# Altium project Flight Controller.PrjPcb
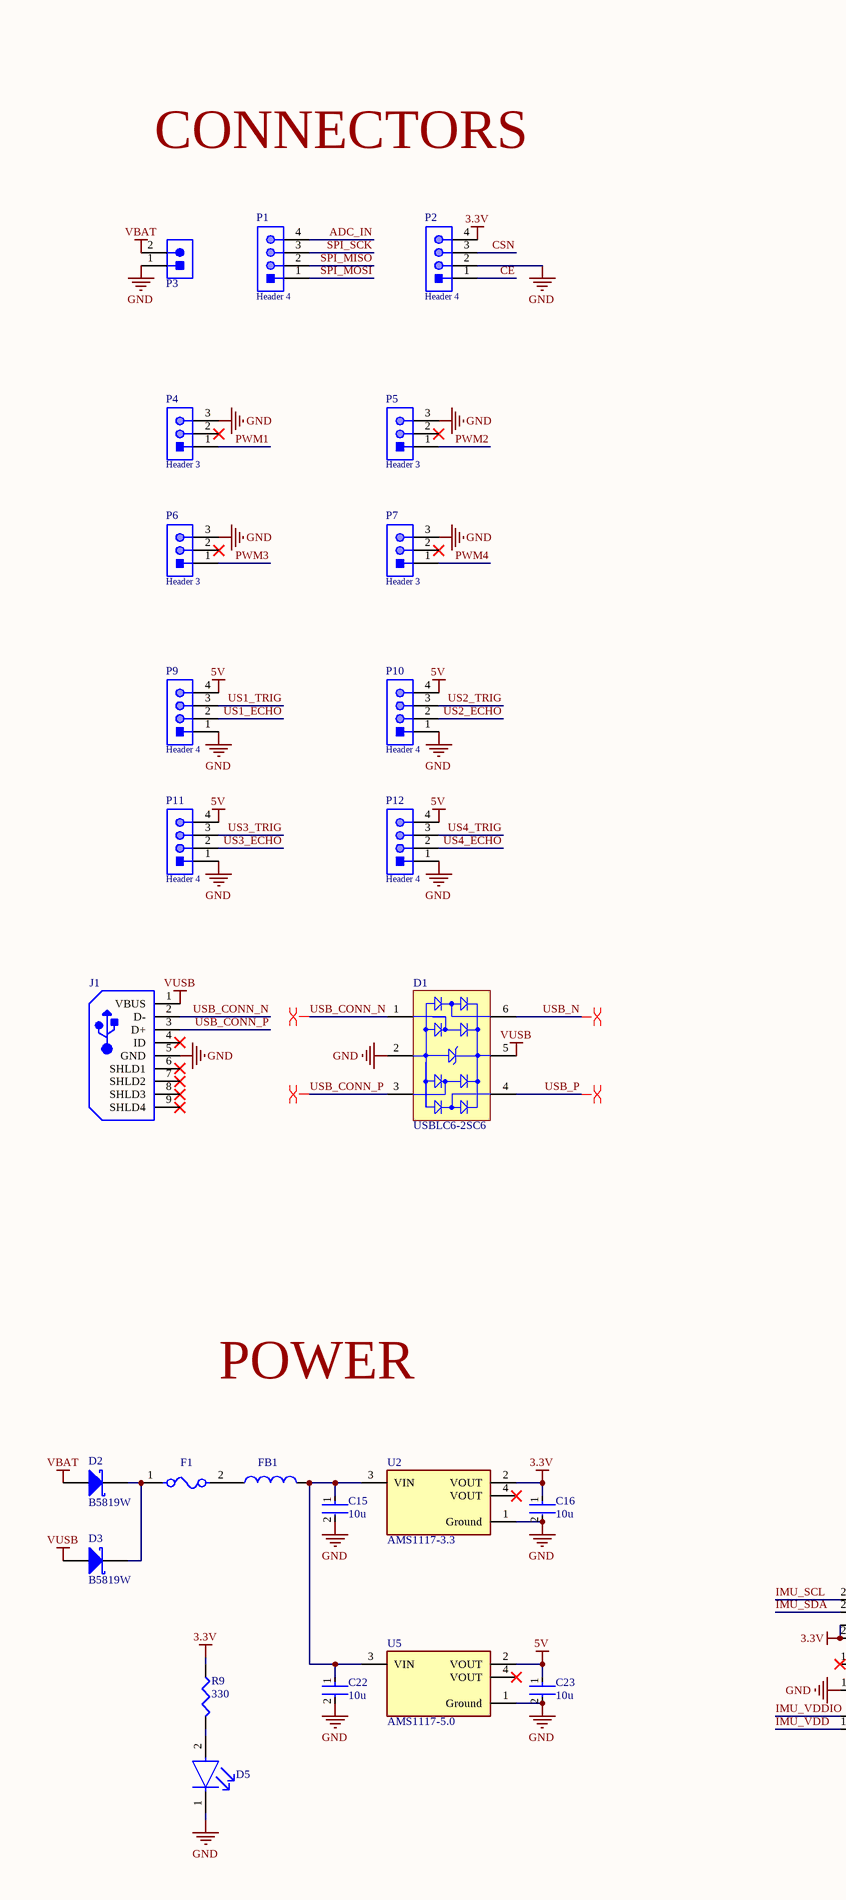
[diagram p0: Flight Controller.SchDoc, left]
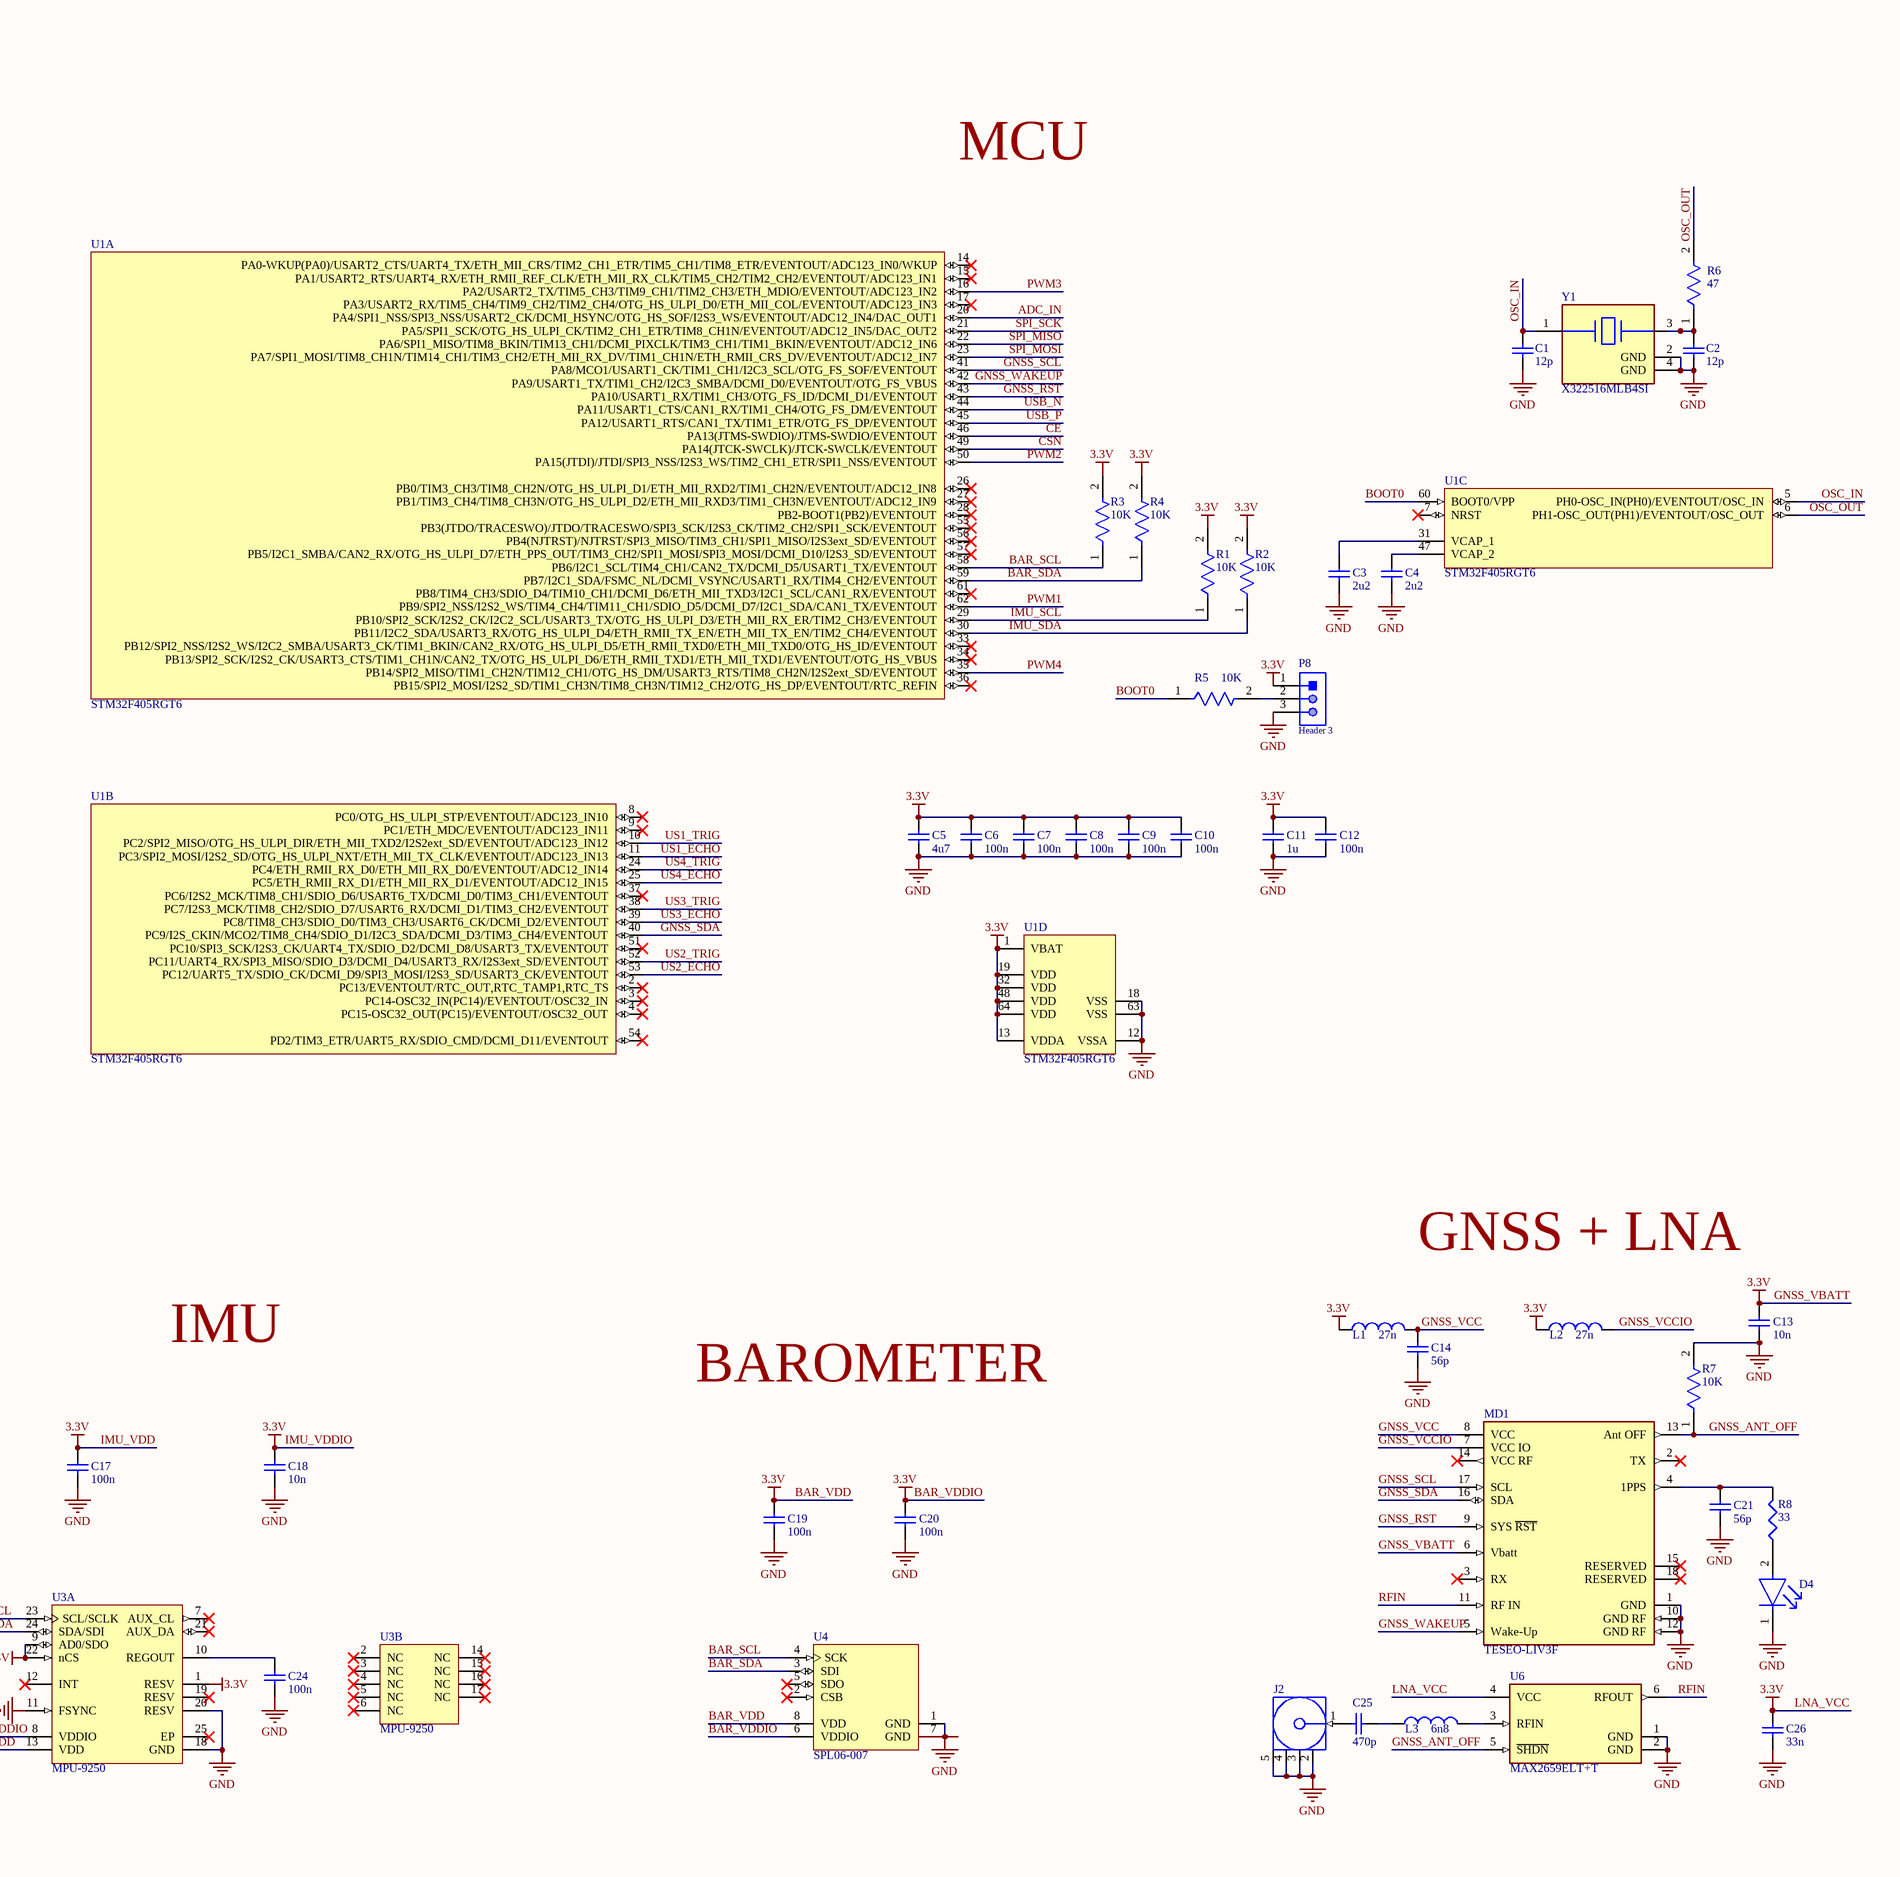
[diagram p1: Flight Controller.SchDoc, right]
1 sheet, 67 parts. Net scope: global (net labels, ports and power ports of the same name join across sheets).
Board file: Flight Controller.PcbDoc

## Sheet Flight Controller.SchDoc
size A2

### Parts
C1  value 12p  [0402]  (hidden comment: Cap Semi)
C2  value 12p  [0402]  (hidden comment: Cap Semi)
C3  value 2u2  [1608[0603]]  (hidden comment: Cap Semi)
C4  value 2u2  [1608[0603]]  (hidden comment: Cap Semi)
C5  value 4u7  [1608[0603]]  (hidden comment: Cap Semi)
C6  value 100n  [0402]  (hidden comment: Cap Semi)
C7  value 100n  [0402]  (hidden comment: Cap Semi)
C8  value 100n  [0402]  (hidden comment: Cap Semi)
C9  value 100n  [0402]  (hidden comment: Cap Semi)
C10  value 100n  [0402]  (hidden comment: Cap Semi)
C11  value 1u  [1608[0603]]  (hidden comment: Cap Semi)
C12  value 100n  [0402]  (hidden comment: Cap Semi)
C13  value 10n  [0402]  (hidden comment: Cap Semi)
C14  value 56p  [0402]  (hidden comment: Cap Semi)
C15  10u  [FP-CL21-IPC_B]
C16  10u  [FP-CL21-IPC_B]
C17  value 100n  [0402]  (hidden comment: Cap Semi)
C18  value 10n  [0402]  (hidden comment: Cap Semi)
C19  value 100n  [0402]  (hidden comment: Cap Semi)
C20  value 100n  [0402]  (hidden comment: Cap Semi)
C21  value 56p  [0402]  (hidden comment: Cap Semi)
C22  10u  [FP-CL21-IPC_B]
C23  10u  [FP-CL21-IPC_B]
C24  value 100n  [0402]  (hidden comment: Cap Semi)
C25  value 470p  [0402]  (hidden comment: Cap Semi)
C26  value 33n  [0402]  (hidden comment: Cap Semi)
D1  USBLC6-2SC6  [STM-SOT23-6L_V]
D2  B5819W  [MCC-SOD123_V]
D3  B5819W  [MCC-SOD123_V]
D4  597-3901-831F  [FP-597-MFG]  (value not drawn)
D5  597-3901-831F  [FP-597-MFG]  (value not drawn)
F1  nSMD050-24V  [FP-0466-MFG]  (value not drawn)
FB1  GZ2012D601TF  [SNLD-CHIP2-2012X105_V]  (value not drawn)
J1  65100516121  [WE-65100516121_V]  (value not drawn)
J2  CONSMA001  [CON-SMA]  (value not drawn)
L1  value 27n  [0402-A]  (hidden comment: Inductor)
L2  value 27n  [0402-A]  (hidden comment: Inductor)
L3  value 6n8  [0402-A]  (hidden comment: Inductor)
MD1  TESEO-LIV3F  [FP-LCC-18-MFG]
P1  Header 4  [61300411121]
P2  Header 4  [61300411121]
P3  SCREW-5.0/5.08 2WAYS  [SCREW-5.0-2WAYS_V]  (value not drawn)
P4  Header 3  [61300311121]
P5  Header 3  [61300311121]
P6  Header 3  [61300311121]
P7  Header 3  [61300311121]
P8  Header 3  [61300311121]
P9  Header 4  [61300411121]
P10  Header 4  [61300411121]
P11  Header 4  [61300411121]
P12  Header 4  [61300411121]
R1  10K  [FP-CRCW0402-e3-MFG]
R2  10K  [FP-CRCW0402-e3-MFG]
R3  10K  [FP-CRCW0402-e3-MFG]
R4  10K  [FP-CRCW0402-e3-MFG]
R5  10K  [FP-CRCW0402-e3-MFG]
R6  47  [FP-CRCW0402-e3-MFG]
R7  10K  [FP-CRCW0402-e3-MFG]
R8  value 33  [J1-0603]  (hidden comment: Res3)
R9  value 330  [J1-0603]  (hidden comment: Res3)
U1  STM32F405RGT6  [STM-LQFP64_N]  (parts A,B,C,D of 4)
U2  AMS1117-3.3  [FP-AMS1117-IPC_C]
U3  MPU-9250  [INSE-QFN-24-1700X1540TP_M]  (parts A,B of 2)
U4  SPL06-007  [BOSC-LGA-8_V]
U5  AMS1117-5.0  [FP-AMS1117-IPC_C]
U6  MAX2659ELT+T  [FP-L611-2-MFG]
Y1  X322516MLB4SI  [FP-XRCJK-MFG]

### Nets
5V: C23.1 P9.4 P10.4 P11.4 P12.4 U5.2(VOUT)
BAR_VDD: C5.2 C6.2 C7.2 C8.2 C9.2 C10.2 C11.2 C12.2 C13.1 C16.1 C17.2 C18.2 C19.1 C20.1 C26.1 L1.1 L2.1 MD1.6(Vbatt) P2.4 P8.1 R1.2 R2.2 R3.2 R4.2 R9.1 U1.1(VBAT) U1.13(VDDA) U1.19(VDD) U1.32(VDD) U1.48(VDD) U1.64(VDD) U2.2(VOUT) U3.1(RESV) U3.8(VDDIO) U3.9(AD0/SDO) U3.13(VDD) U3.22(nCS) U4.6(VDDIO) U4.8(VDD) U6.4(VCC)  [also labelled 3.3V, BAR_VDDIO, GNSS_VBATT, IMU_VDD, IMU_VDDIO, LNA_VCC]
GND: C1.2 C2.2 C3.1 C4.1 C5.1 C6.1 C7.1 C8.1 C9.1 C10.1 C11.1 C12.1 C13.2 C14.1 C15.2 C16.2 C17.1 C18.1 C19.2 C20.2 C21.2 C22.2 C23.2 C24.1 C26.2 D1.2(GND) D4.1(C) D5.1(C) J1.5(GND) J2.2(GND) J2.3(GND) J2.4(GND) J2.5(GND) MD1.1(GND) MD1.10(GND_RF) MD1.12(GND_RF) P2.2 P3.1 P4.3 P5.3 P6.3 P7.3 P8.3 P9.1 P10.1 P11.1 P12.1 R7.2 U1.12(VSSA) U1.18(VSS) U1.63(VSS) U2.1(Ground) U3.11(FSYNC) U3.18(GND) U3.20(RESV) U4.1(GND) U4.7(GND) U5.1(Ground) U6.1(GND) U6.2(GND) Y1.2(GND) Y1.4(GND)
VBAT: D2.1(A) P3.2
VUSB: D1.5(VBUS) D3.1(A) J1.1(VBUS)
ADC_IN: P1.4 U1.20(PA4/SPI1_NSS/SPI3_NSS/USART2_CK/DCMI_HSYNC/OTG_HS_SOF/I2S3_WS/EVENTOUT/ADC12_IN4/DAC_OUT1)
BAR_SCL: R3.1 U1.58(PB6/I2C1_SCL/TIM4_CH1/CAN2_TX/DCMI_D5/USART1_TX/EVENTOUT) U4.4(SCK)
BAR_SDA: R4.1 U1.59(PB7/I2C1_SDA/FSMC_NL/DCMI_VSYNC/USART1_RX/TIM4_CH2/EVENTOUT) U4.3(SDI)
BOOT0: R5.1 U1.60(BOOT0/VPP)
CE: P2.1 U1.46(PA13(JTMS-SWDIO)/JTMS-SWDIO/EVENTOUT)
CSN: P2.3 U1.49(PA14(JTCK-SWCLK)/JTCK-SWCLK/EVENTOUT)
GNSS_ANT_OFF: MD1.13(Ant_OFF) R7.1 U6.5(~{SHDN})
GNSS_RST: MD1.9(SYS_~{RST}) U1.43(PA10/USART1_RX/TIM1_CH3/OTG_FS_ID/DCMI_D1/EVENTOUT)
GNSS_SCL: MD1.17(SCL) U1.41(PA8/MCO1/USART1_CK/TIM1_CH1/I2C3_SCL/OTG_FS_SOF/EVENTOUT)
GNSS_SDA: MD1.16(SDA) U1.40(PC9/I2S_CKIN/MCO2/TIM8_CH4/SDIO_D1/I2C3_SDA/DCMI_D3/TIM3_CH4/EVENTOUT)
GNSS_VCC: C14.2 L1.2 MD1.8(VCC)
GNSS_VCCIO: L2.2 MD1.7(VCC_IO)
GNSS_WAKEUP: MD1.5(Wake-Up) U1.42(PA9/USART1_TX/TIM1_CH2/I2C3_SMBA/DCMI_D0/EVENTOUT/OTG_FS_VBUS)
IMU_SCL: R1.1 U1.29(PB10/SPI2_SCK/I2S2_CK/I2C2_SCL/USART3_TX/OTG_HS_ULPI_D3/ETH_MII_RX_ER/TIM2_CH3/EVENTOUT) U3.23(SCL/SCLK)
IMU_SDA: R2.1 U1.30(PB11/I2C2_SDA/USART3_RX/OTG_HS_ULPI_D4/ETH_RMII_TX_EN/ETH_MII_TX_EN/TIM2_CH4/EVENTOUT) U3.24(SDA/SDI)
OSC_IN: C1.1 U1.5(PH0-OSC_IN(PH0)/EVENTOUT/OSC_IN) Y1.1
OSC_OUT: R6.2 U1.6(PH1-OSC_OUT(PH1)/EVENTOUT/OSC_OUT)
PWM1: P4.1 U1.62(PB9/SPI2_NSS/I2S2_WS/TIM4_CH4/TIM11_CH1/SDIO_D5/DCMI_D7/I2C1_SDA/CAN1_TX/EVENTOUT)
PWM2: P5.1 U1.50(PA15(JTDI)/JTDI/SPI3_NSS/I2S3_WS/TIM2_CH1_ETR/SPI1_NSS/EVENTOUT)
PWM3: P6.1 U1.16(PA2/USART2_TX/TIM5_CH3/TIM9_CH1/TIM2_CH3/ETH_MDIO/EVENTOUT/ADC123_IN2)
PWM4: P7.1 U1.35(PB14/SPI2_MISO/TIM1_CH2N/TIM12_CH1/OTG_HS_DM/USART3_RTS/TIM8_CH2N/I2S2ext_SD/EVENTOUT)
RFIN: MD1.11(RF_IN) U6.6(RFOUT)
SPI_MISO: P1.2 U1.22(PA6/SPI1_MISO/TIM8_BKIN/TIM13_CH1/DCMI_PIXCLK/TIM3_CH1/TIM1_BKIN/EVENTOUT/ADC12_IN6)
SPI_MOSI: P1.1 U1.23(PA7/SPI1_MOSI/TIM8_CH1N/TIM14_CH1/TIM3_CH2/ETH_MII_RX_DV/TIM1_CH1N/ETH_RMII_CRS_DV/EVENTOUT/ADC12_IN7)
SPI_SCK: P1.3 U1.21(PA5/SPI1_SCK/OTG_HS_ULPI_CK/TIM2_CH1_ETR/TIM8_CH1N/EVENTOUT/ADC12_IN5/DAC_OUT2)
US1_ECHO: P9.2 U1.11(PC3/SPI2_MOSI/I2S2_SD/OTG_HS_ULPI_NXT/ETH_MII_TX_CLK/EVENTOUT/ADC123_IN13)
US1_TRIG: P9.3 U1.10(PC2/SPI2_MISO/OTG_HS_ULPI_DIR/ETH_MII_TXD2/I2S2ext_SD/EVENTOUT/ADC123_IN12)
US2_ECHO: P10.2 U1.53(PC12/UART5_TX/SDIO_CK/DCMI_D9/SPI3_MOSI/I2S3_SD/USART3_CK/EVENTOUT)
US2_TRIG: P10.3 U1.52(PC11/UART4_RX/SPI3_MISO/SDIO_D3/DCMI_D4/USART3_RX/I2S3ext_SD/EVENTOUT)
US3_ECHO: P11.2 U1.39(PC8/TIM8_CH3/SDIO_D0/TIM3_CH3/USART6_CK/DCMI_D2/EVENTOUT)
US3_TRIG: P11.3 U1.38(PC7/I2S3_MCK/TIM8_CH2/SDIO_D7/USART6_RX/DCMI_D1/TIM3_CH2/EVENTOUT)
US4_ECHO: P12.2 U1.25(PC5/ETH_RMII_RX_D1/ETH_MII_RX_D1/EVENTOUT/ADC12_IN15)
US4_TRIG: P12.3 U1.24(PC4/ETH_RMII_RX_D0/ETH_MII_RX_D0/EVENTOUT/ADC12_IN14)
USB_CONN_N: D1.1(I/O_1) J1.2(D-)
USB_CONN_P: D1.3(I/O_2) J1.3(D+)
USB_N: D1.6(I/O_4) U1.44(PA11/USART1_CTS/CAN1_RX/TIM1_CH4/OTG_FS_DM/EVENTOUT)
USB_P: D1.4(I/O_3) U1.45(PA12/USART1_RTS/CAN1_TX/TIM1_ETR/OTG_FS_DP/EVENTOUT)
NetC2_1: C2.1 R6.1 Y1.3
NetC3_2: C3.2 U1.31(VCAP_1)
NetC4_2: C4.2 U1.47(VCAP_2)
NetC15_1: C15.1 C22.1 FB1.2 U2.3(VIN) U5.3(VIN)
NetC21_1: C21.1 MD1.4(1PPS) R8.2
NetC24_2: C24.2 U3.10(REGOUT)
NetC25_1: C25.1 J2.1(Signal)
NetC25_2: C25.2 L3.1
NetD2_2: D2.2(K) D3.2(K) F1.1
NetD4_2: D4.2(A) R8.1
NetD5_2: D5.2(A) R9.2
NetF1_2: F1.2 FB1.1
NetL3_2: L3.2 U6.3(RFIN)
NetP8_2: P8.2 R5.2

Not connected (* = marked no-connect by the designer): J1 4(ID)* 6(SHLD1)* 7(SHLD2)* 8(SHLD3)* 9(SHLD4)*; MD1 2(TX)* 3(RX)* 14(VCC_RF)* 15(RESERVED)* 18(RESERVED)*; P4 2*; P5 2*; P6 2*; P7 2*; U1 2(PC13/EVENTOUT/RTC_OUT,RTC_TAMP1,RTC_TS)* 3(PC14-OSC32_IN(PC14)/EVENTOUT/OSC32_IN)* 4(PC15-OSC32_OUT(PC15)/EVENTOUT/OSC32_OUT)* 7(NRST)* 8(PC0/OTG_HS_ULPI_STP/EVENTOUT/ADC123_IN10)* 9(PC1/ETH_MDC/EVENTOUT/ADC123_IN11)* 14(PA0-WKUP(PA0)/USART2_CTS/UART4_TX/ETH_MII_CRS/TIM2_CH1_ETR/TIM5_CH1/TIM8_ETR/EVENTOUT/ADC123_IN0/WKUP)* 15(PA1/USART2_RTS/UART4_RX/ETH_RMII_REF_CLK/ETH_MII_RX_CLK/TIM5_CH2/TIM2_CH2/EVENTOUT/ADC123_IN1)* 17(PA3/USART2_RX/TIM5_CH4/TIM9_CH2/TIM2_CH4/OTG_HS_ULPI_D0/ETH_MII_COL/EVENTOUT/ADC123_IN3)* 26(PB0/TIM3_CH3/TIM8_CH2N/OTG_HS_ULPI_D1/ETH_MII_RXD2/TIM1_CH2N/EVENTOUT/ADC12_IN8)* 27(PB1/TIM3_CH4/TIM8_CH3N/OTG_HS_ULPI_D2/ETH_MII_RXD3/TIM1_CH3N/EVENTOUT/ADC12_IN9)* 28(PB2-BOOT1(PB2)/EVENTOUT)* 33(PB12/SPI2_NSS/I2S2_WS/I2C2_SMBA/USART3_CK/TIM1_BKIN/CAN2_RX/OTG_HS_ULPI_D5/ETH_RMII_TXD0/ETH_MII_TXD0/OTG_HS_ID/EVENTOUT)* 34(PB13/SPI2_SCK/I2S2_CK/USART3_CTS/TIM1_CH1N/CAN2_TX/OTG_HS_ULPI_D6/ETH_RMII_TXD1/ETH_MII_TXD1/EVENTOUT/OTG_HS_VBUS)* 36(PB15/SPI2_MOSI/I2S2_SD/TIM1_CH3N/TIM8_CH3N/TIM12_CH2/OTG_HS_DP/EVENTOUT/RTC_REFIN)* 37(PC6/I2S2_MCK/TIM8_CH1/SDIO_D6/USART6_TX/DCMI_D0/TIM3_CH1/EVENTOUT)* 51(PC10/SPI3_SCK/I2S3_CK/UART4_TX/SDIO_D2/DCMI_D8/USART3_TX/EVENTOUT)* 54(PD2/TIM3_ETR/UART5_RX/SDIO_CMD/DCMI_D11/EVENTOUT)* 55(PB3(JTDO/TRACESWO)/JTDO/TRACESWO/SPI3_SCK/I2S3_CK/TIM2_CH2/SPI1_SCK/EVENTOUT)* 56(PB4(NJTRST)/NJTRST/SPI3_MISO/TIM3_CH1/SPI1_MISO/I2S3ext_SD/EVENTOUT)* 57(PB5/I2C1_SMBA/CAN2_RX/OTG_HS_ULPI_D7/ETH_PPS_OUT/TIM3_CH2/SPI1_MOSI/SPI3_MOSI/DCMI_D10/I2S3_SD/EVENTOUT)* 61(PB8/TIM4_CH3/SDIO_D4/TIM10_CH1/DCMI_D6/ETH_MII_TXD3/I2C1_SCL/CAN1_RX/EVENTOUT)*; U2 4(VOUT)*; U3 2(NC)* 3(NC)* 4(NC)* 5(NC)* 6(NC)* 7(AUX_CL)* 12(INT)* 14(NC)* 15(NC)* 16(NC)* 17(NC)* 19(RESV)* 21(AUX_DA)* 25(EP)*; U4 2(CSB)* 5(SDO)*; U5 4(VOUT)*

### Layout directives
differential pair: USB_CONN_N, USB_CONN_P, USB_N, USB_P

### Notes on the sheet
- CONNECTORS
- MCU
- GNSS + LNA
- IMU
- POWER
- BAROMETER

### Library data of the parts
C1-C14 C17-C21 C24-C26 = Cap Semi: Capacitor (Semiconductor SIM Model); Published: 8-Jun-2000; LatestRevisionDate: 29-May-2009; LatestRevisionNote: IPC-7351 Footprint Added.; PackageReference: C1206; Publisher: Altium Limited; PackageDescription: Chip Capacitor
C15 C16 C22 C23 = CMP-13271-002975-1: CL21 Series 0805 10uF 25V ±10% Tolerance X5R Multilayer Ceramic Chip Capacitor; Case Code (Imperial): 0805; Length: 2mm; Case/Package: 0805; Packaging: Tape and Reel; Width: 0.049inch; Tolerance: 10%; Mount: Surface Mount; Min Operating Temperature: -55°C; Thickness: 0.057inch; Height: 1.25mm; Dielectric: X5R; Package Quantity: 1; Depth: 1.25mm; Capacitance: 10uF; Voltage Rating: 25V; Case Code (Metric): 2012; Max Operating Temperature: 85°C; Radiation Hardening: No
D1 = CMP-2000-05378-1: Very low capacitance ESD protection, 3.5 pF, -40 to 125 degC, 6-Pin SOT23, RoHS, Tape and Reel; Manufacturer: STMicroelectronics; Polarity: Uni-Directional; Clamping Voltage: 17V; Rad Hardened: No; Product Height (mm): 1.3mm; Leakage Current (Max): 0.15uA; Product Length (mm): 3.05mm; Number of Elements: 1; Peak Pulse Current: 5A; Configuration: Dual; Reverse Breakdown Voltage: 6V; Working Voltage (Max): 5V; Capacitance Value: 3.5pF; Suppressor Type: DiodeArrays; Product Depth (mm): 1.75mm; Test Current (It): 1mA; Package / Case: SOT-23; Operating Temperature Max Deg. C: 125C; Package Description: 6-Pin Small Outline Transistor, Body 2.925 x 1.625 mm, Pitch 0.95 mm; Package Reference: SOT23-6L; Datasheet Version: Rev. 5, 10/2011; Operating Temperature Min Deg. C: -40C; Mounting Style: SurfaceMount; Direction Type: Uni-Directional; Mounting: SurfaceMount; Pin Count: 6; Leakage Current: 0.15uA; Packaging: TapeandReel; Operating Temperature Classification: Automotive; Clamping Voltage (Max): 17V; Manufacturer URL: http://www.st.com/; Reverse Stand-off Voltage: 5V; Datasheet URL: http://www.st.com/st-web-ui/static/active/en/resource/technical/document/datasheet/CD00050750.pdf; Working Voltage: 5V; Operating Temp Range: -40Cto125C
D2 D3 = CMP-2100-03587-1: Schottky Barrier Rectifier, 1 A, 40 Vrm, -65 to 125 degC, 2-Pin SOD123, RoHS, Tape and Reel; Manufacturer: Micro Commercial Components; Package Description: 2-Pin Small Outline Diode, Body 2.7 x 1.6 mm, Height 1.35 mm; Datasheet URL: http://www.mccsemi.com/up_pdf/B5817W-B5819W(SOD-123).pdf; Manufacturer URL: http://www.mccsemi.com/; Package Reference: SOD123; Package URL: http://www.mccsemi.com/up_pdf/1N4448W(SOD-123).pdf; Datasheet Version: Rev. B, 01/2013
D4 D5 = CMP-15384-000003-1: LED COOL WHITE 2SMD; Manufacturer: Dialight; Forward Voltage: 3.4V; Viewing Angle: 130°; Forward Current: 10mA; Reverse Voltage: 5V; Power Dissipation: 70mW; Led Orientation: Top View; Luminous Intensity: 112-240mcd; Package: 597; Octopart: https://octopart.com/597-3901-831f-dialight-10598902; Device Class L3: unset; Lead Free: Yes; Digikey Description: LED COOL WHITE 2SMD; Temperature Range High: +80°C; ComponentLink2Description: Datasheet; Device Class L2: LEDs; ComponentLink2URL: http://www.dialightsignalsandcomponents.com/Assets/Drawings/2D_Drawings_DrawingDetailedSpec/C17584.PDF; Colour: White; Manufacturer Part Number: 597-3901-831F; RoHS: TRUE; Height: 0.026inch; Category: Diode; Automotive: No; Mouser Description: Standard LEDs - SMD White, 20mA; Temperature: -20°C to +80°C; Temperature Range Low: -20°C; Device Class L1: Optoelectronics
F1 = CMP-08605-000058-1: FUSE BOARD MNT 1A 63VAC/VDC 1206; Manufacturer Part Number: 0466001.NR; Manufacturer: Littelfuse Inc; Max Fuse Dc Voltage: 63V; Fuse Interrupt Ac Current: 50A; Fuse Voltage Drop: 79.97mV; Resistance: 0.075Ω; Value: 0.075Ω; Fuse I2T: 0.0423A2Sec; Fuse Blow Speed: Fast; Temperature Range High: +90°C; Max Fuse Ac Voltage: 63V; Package: 0466; ComponentLink2URL: https://www.littelfuse.com/~/media/electronics/datasheets/fuses/littelfuse_fuse_466_datasheet.pdf.pdf; Device Class L3: unset; Lead Free: Yes; Automotive: No; Digikey Description: FUSE BOARD MNT 1A 63VAC/VDC 1206; Height: 0.66mm; Temperature Range Low: -55°C; Category: Fuse; ComponentLink2Description: Datasheet; Device Class L1: Circuit Protection; Device Class L2: Fuses; Fuse Current: 1A; Mouser Description: Surface Mount Fuses 63V FA 1206 1A VFA Slimline; Octopart: https://octopart.com/0466001.nr-littelfuse-566005; Fuse Interrupt Dc Current: 50A; RoHS: TRUE; Voltage Rating: 63V; Temperature: -55°C to +90°C
FB1 = CMP-0712-00004-1: Multilayer Chip Ferrite Bead - GZ Series, 600 +/- 25% Ohm, 100 MHz, 500mA, -55 to 125 degC, 2-Pin 2 x 1.25 x 1.05 mm, Tape and Reel; Manufacturer: Sunlord; Max. Rated Current (mA): 500; Z Test Frequency (MHz): 100; Max. DC Resistance (Ohm): 0.3; ComponentLink2Description: Datasheet; PackageVersion: 08/2011; Packing: Tape and Reel; ComponentLink3Description: Package Specification; ComponentLink3URL: http://www.sunlordinc.com/ewebeditor/uploadfile/20120428161759144.pdf; PackageReference: CHIP-2012-2; Impedance (Ohm): 600 +/- 25%; ComponentLink1Description: Manufacturer URL; PackageDescription: 2-Pin Chip, Body 2 x 1.25 mm, Height 1.05 mm; Operating Temperature Range: -55 to 125 degC; ComponentLink1URL: http://www.sunlordinc.com/; DatasheetVersion: 05/2013; ComponentLink2URL: http://www.sunlordinc.com/UploadFiles/PDF_Cat/20130503142421156.pdf; PartNumber: GZ2012D601TF; Mounting Technology: Surface Mount
J1 = CMP-2000-05576-1: MINI USB 2.0 SMT Type B 5 Contacts, 30 V, -40 to 105 degC, RoHS, Tape and Reel; Manufacturer: Wuerth Elektronik; Package Description: 5-Pin Surface Mount Device, Body 9.6 x 9.25 mm, Pitch 0.8 mm; Mounting Technology: SurfaceMount; Package Reference: 65100516121; Manufacturer URL: https://www.we-online.com/; Datasheet Version: Rev. H, 02/2013; Datasheet URL: https://datasheet.ciiva.com/4598/65100516121-83749-4598775.pdf
J2 = CMP-0168-00006-1: Female PCB Mount Connector, Thru-Hole; PackageReference: CON-SMA; PackageDescription: SMA Female PCB Mount Connector, Thru-Hole, 7 x 7 mm Body; DatasheetVersion: rev1.1, Jan-2008; PackageVersion: rev1.1, Jan-2008
L1-L3 = Inductor: Code_IEC: 1005; Published: 8-Jun-2000; LatestRevisionDate: 29-May-2009; LatestRevisionNote: IPC-7351 Footprint Added.; PackageReference: 0402-A; Publisher: Altium Limited; PackageDescription: Chip Inductor; Code_JEITA: 0402
MD1 = CMP-12160-000003-1: RF RCVR GNSS/GPS 1.575GHZ 18LCC; Manufacturer: STMicroelectronics; Min Supply Voltage: 2.1V; Max Supply Voltage: 4.3V; Interface: I2C,UART; Sensitivity: -163dBm; Max Frequency: 1575.42MHz; ComponentLink2Description: Datasheet; Package: LCC-18; RoHS: TRUE; Temperature Range Low: -40°C; Manufacturer Part Number: TESEO-LIV3F; Ambient Temperature Range Low: -40°C; ComponentLink2URL: https://www.st.com/resource/en/datasheet/teseo-liv3f.pdf; Octopart: https://octopart.com/teseo-liv3f-stmicroelectronics-84762432; Device Class L1: Integrated Circuits (ICs); Mouser Description: Rf Receiver, 1.57542Ghz, -40 To 85Deg C; Digikey Description: RF RCVR GNSS/GPS 1.575GHZ 18LCC; Device Class L3: RF Receivers; Ambient Temperature Range High: +85°C; Temperature Range High: +85°C; Lead Free: Yes; Height: 2.33mm; Automotive: No; Category: UNK; Temperature: -40°C to +85°C; Device Class L2: RF Semiconductors and Devices
P1 P2 P9-P12 = CMP-1502-01064-1: THT Vertical Pin Header WR-PHD, Pitch 2.54 mm, Single Row, 4 pins; Manufacturer: Wurth Elektronik; Withstanding Voltage: 500VAC; Rated Current: 3A; Working Voltage: 250VAC; Pin Number: 4; Gender: Male; Contact Resistance: 20mOhm; Pitch: 2.54mm; Manufacturer URL: http://www.we-online.de; Operating Temperature: -40to105degC; Packaging: Bag; Mounting Technology: THT; Package Reference: 61300411121; Datasheet URL: https://katalog.we-online.de/em/datasheet/6130xx11121.pdf; Publisher: WurthElektronik; Part Number: 61300411121; Row Number: Single; Orientation: Vertical
P3 = CMP-0617-00009-1: Socket, Screw Terminal Block, 2 Way, 5.0 mm Pitch, 90 Degree Angle, Through-Hole; Manufacturer: No Vendor; Insulation Resistance: 5000 MOhm / 1000 V; Contact Resistance: 20 mOhm; Rated Current: 25 A; Poles: 2; Rated Voltage: 300 V; PartNumber: SCREW-5.0/5.08 2WAYS; ComponentLink1Description: Datasheet; ComponentLink1URL: 5mm screw terminal in SVN; Mounting Technology: Through Hole; PackageDescription: Socket, Screw Terminal Block, 2 Way, Pitch 5 mm, 90 Degree Angle, Through-Hole; Temperature Range: -40 to 105 degC
P4-P8 = CMP-1502-01062-1: THT Vertical Pin Header WR-PHD, Pitch 2.54 mm, Single Row, 3 pins; Manufacturer: Wurth Elektronik; Withstanding Voltage: 500VAC; Working Voltage: 250VAC; Rated Current: 3A; Pitch: 2.54mm; Pin Number: 3; Gender: Male; Contact Resistance: 20mOhm; Package Reference: 61300311121; Manufacturer URL: http://www.we-online.de; Datasheet URL: https://katalog.we-online.de/em/datasheet/6130xx11121.pdf; Operating Temperature: -40to105degC; Part Number: 61300311121; Orientation: Vertical; Packaging: Bag; Row Number: Single; Mounting Technology: THT; Publisher: WurthElektronik
R1-R7 = CMP-2002-08135-2: RES SMD 10K OHM 1% 1/16W 0402; Power Rating: 63mW; Resistance: 10kR; Voltage Rating: 50V; Temperature Coefficient: 100ppm/°C; Case Code (Metric): 1005; Features: Automotive AEC-Q200; Termination: SMD/SMT; Mount: Surface Mount; Package Quantity: 10; Packaging: Tape and Reel; Case Code (Imperial): 0402; Weight: 2.3E-05oz; Lead Free: Lead Free; Width: 0.02inch; Max Power Dissipation: 63mW; Tolerance: 1%; Number of Terminations: 2; Height: 0.35mm; Number of Pins: 2; Composition: Thick Film; Length: 1mm; Voltage Rating (DC): 50V; Case/Package: 0402; Radiation Hardening: No; Contact Plating: Tin; Depth: 0.5mm; Military Standard: Not; Min Operating Temperature: -55°C; Max Operating Temperature: 155°C
R8 R9 = Res3: Resistor; Published: 8-Jun-2000; LatestRevisionDate: 29-May-2009; LatestRevisionNote: IPC-7351 Footprint Added.; PackageReference: J1-0603; Publisher: Altium Limited; PackageDescription: Chip Resistor
U1 = CMP-0243-00019-2: ARM Cortex-M4 32-bit MCU+FPU, 210 DMIPS, 1024 kB Flash, 192 kB Internal RAM, 51 I/Os, 64-pin LQFP, -40 to 85 degC, Tray; Manufacturer: STMicroelectronics; Supply Voltage(Vcc) max (V): 3.6; Internal RAM Size (kB): 192; I/Os (High Current): 51; Operating Frequency(F) (Processor speed) (MHz): 168; D/A Converter: 2x12-bit; Supply Voltage(Vcc) min (V): 1.8; FLASH Size (Prog) (kB): 1024; PartNumber: STM32F405RGT6; ComponentLink1Description: Manufacturer URL; PackageDescription: 64-Pin Low Profile Quad Flat Package, 10 x 10 mm Body, 0.5 mm Pitch; Packing: Tray; Core: ARM Cortex-M4; PackageVersion: Rev. 4, 06/2013; DatasheetVersion: Rev. 4; ComponentLink3URL: http://www.st.com/st-web-ui/static/active/en/resource/technical/document/datasheet/DM00037051.pdf; Mounting Technology: Surface Mount; ComponentLink1URL: http://www.st.com/web/en/home.html; ComponentLink2Description: Datasheet; ComponentLink3Description: Package Specification; ComponentLink2URL: http://www.st.com/st-web-ui/static/active/en/resource/technical/document/datasheet/DM00037051.pdf; PackageReference: LQFP64; PartId: 1
U2 = CMP-209535-000001-1: LDO Voltage Regulators 1A, 3.3V; Manufacturer: Advanced Monolithic Systems; Dropout Voltage: 1.1V; Output Type: Fixed; Nominal Supply Current: 5mA; Max Power Dissipation: 1.2W; Max Supply Voltage: 15V; Number Of Outputs: 1; Standoff Height: 0.64mm; Max Junction Temp: +125°C; Height: 1.8mm; Package: AMS1117; Device Class L2: Power Management ICs; ComponentLink2Description: Datasheet; ComponentLink2URL: http://www.advanced-monolithic.com/pdf/ds1117.pdf; Category: IC; RoHS: TRUE; Automotive: No; Device Class L1: Integrated Circuits (ICs); Output Current: 1A; Device Class L3: Voltage Regulators - Linear; Temperature: -40°C to +125°C; Output Voltage: 3.3V; Manufacturer Part Number: AMS1117-3.3; Temperature Range Low: -40°C; Octopart: https://octopart.com/ams1117-3.3-advanced+monolithic+systems-25899300; Lead Free: Yes; Ipc Land Pattern Name: SOT229P700X180-4; Temperature Range High: +125°C
U3 = CMP-2100-03657-1: 9-axis MotionTracking device, 2.4 to 3,6 V, -40 to 85 degC, 24-Pin QFN, RoHS, Tape and Reel; Manufacturer: InvenSense; Max Supply Voltage: 3.6V; Min Supply Voltage: 2.4V; Package Reference: QFN-24; Package Quantity: 1; Datasheet Version: Rev. 1.0, 01/2014; Case/Package: QFN; Package Description: 24-Pin Quad Flat No-lead Package, Body 3 x 3 mm, Pitch 0.4 mm; Datasheet URL: http://datasheet.octopart.com/MPU-9250-InvenSense-datasheet-21859386.pdf; RoHSCompliant: true; Max Operating Temperature: 85degC; Height: 1mm; Mount: SurfaceMount; Manufacturer URL: http://www.invensense.com/; Width: 3.1mm; Min Operating Temperature: -40degC; Length: 3.1mm; PartId: 1
U4 = CMP-2000-05076-1: Digital Pressure Sensor, 1.71 to 3.6 V, -40 to 85 degC, 8-Pin LGA, RoHS, Tape and Reel; Manufacturer: Bosch Sensortec; Manufacturer URL: http://www.bosch-sensortec.com; Datasheet URL: http://datasheet.octopart.com/BMP280-Bosch-datasheet-41546027.pdf; Datasheet Version: Rev. 1.14, 05/2015
U5 = CMP-209535-000001-1: LDO Voltage Regulators 1A, 5V; Manufacturer Part Number: AMS1117-3.3; Manufacturer: Advanced Monolithic Systems; Dropout Voltage: 1.1V; Output Type: Fixed; Nominal Supply Current: 5mA; Output Voltage: 3.3V; Max Power Dissipation: 1.2W; Max Supply Voltage: 15V; Number Of Outputs: 1; Standoff Height: 0.64mm; Max Junction Temp: +125°C; Height: 1.8mm; Package: AMS1117; Device Class L2: Power Management ICs; ComponentLink2Description: Datasheet; ComponentLink2URL: http://www.advanced-monolithic.com/pdf/ds1117.pdf; Category: IC; RoHS: TRUE; Automotive: No; Device Class L1: Integrated Circuits (ICs); Output Current: 1A; Device Class L3: Voltage Regulators - Linear; Temperature: -40°C to +125°C; Temperature Range Low: -40°C; Octopart: https://octopart.com/ams1117-3.3-advanced+monolithic+systems-25899300; Lead Free: Yes; Ipc Land Pattern Name: SOT229P700X180-4; Temperature Range High: +125°C
U6 = CMP-05725-000003-1: GPS Amp Single Low Noise 1.75GHz 3.6V 6-Pin UDFN; Number of Pins: 6; Contact Plating: Gold
Y1 = CMP-06057-000004-1: Crystal Unit SMD 3225 Seam Sealing 20MHz 10ppm